# Altium schematic sheet 08_PL_ETH_1.SchDoc
size A3
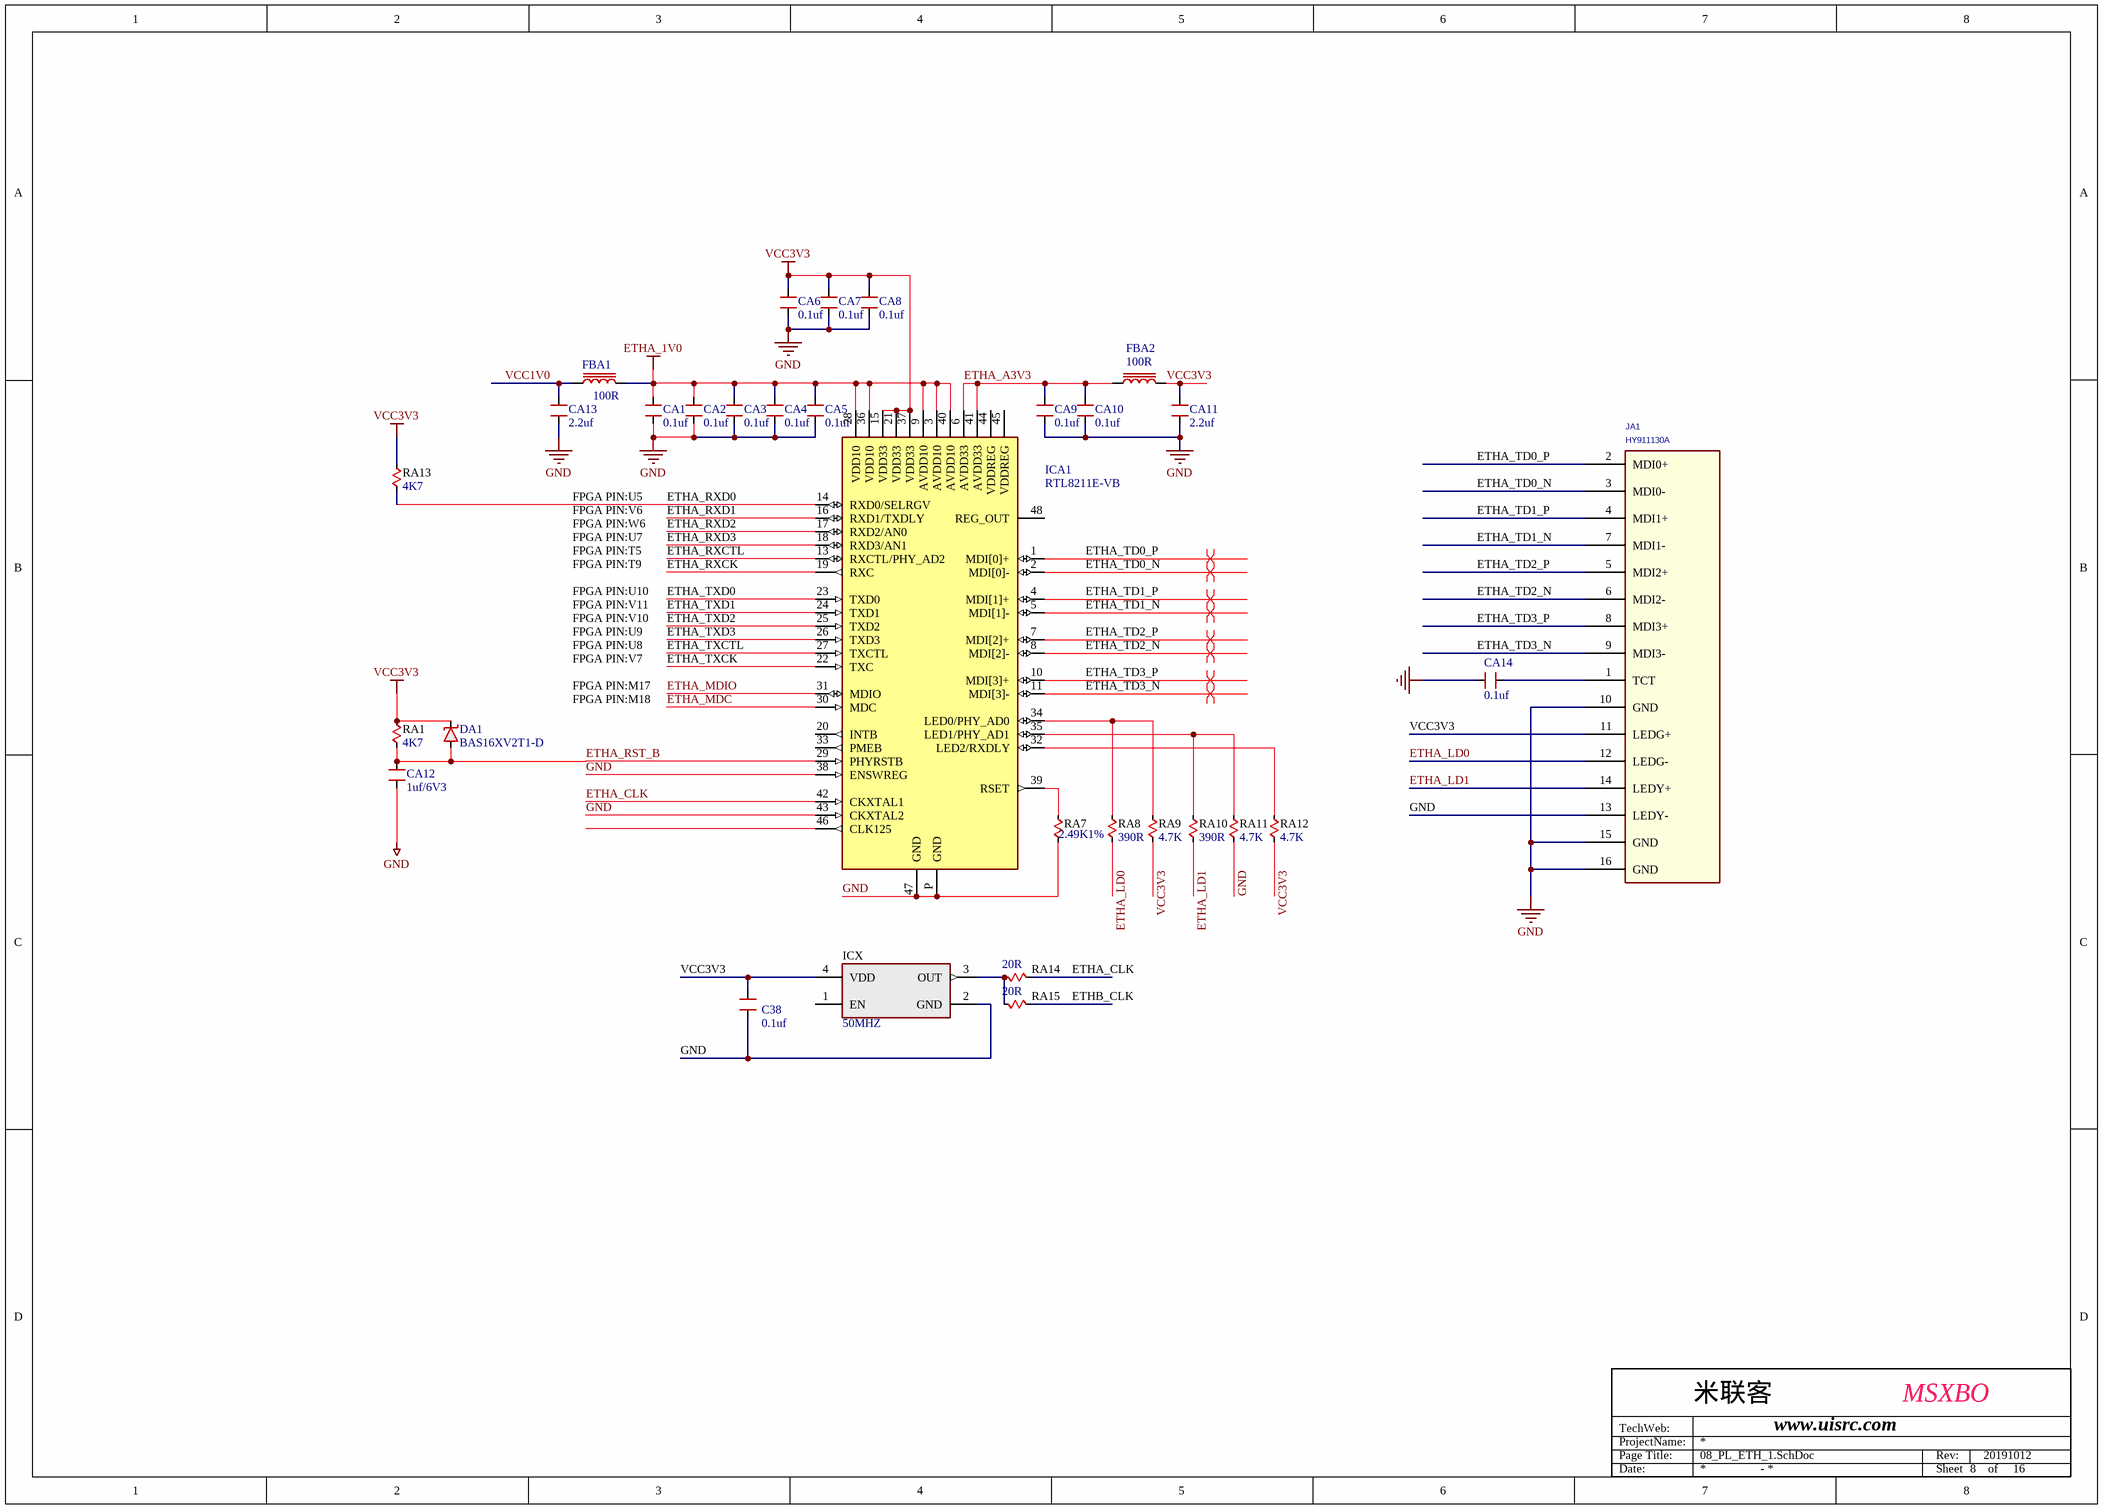
[diagram p0: 08_PL_ETH_1.SchDoc]

## Parts
C38  0.1uf  [CAP0402]
CA1  0.1uf  [CAP0402]
CA2  0.1uf  [CAP0402]
CA3  0.1uf  [CAP0402]
CA4  0.1uf  [CAP0402]
CA5  0.1uf  [CAP0402]
CA6  0.1uf  [CAP0402]
CA7  0.1uf  [CAP0402]
CA8  0.1uf  [CAP0402]
CA9  0.1uf  [CAP0402]
CA10  0.1uf  [CAP0402]
CA11  2.2uf  [CAP0402]
CA12  1uf/6V3  [CAP0402]
CA13  2.2uf  [CAP0402]
CA14  0.1uf  [CAP0402]
DA1  BAS16XV2T1-D  [SOD-523]
FBA1  100R  [CAP0603]
FBA2  100R  [CAP0603]
ICA1  RTL8211E-VB  [QFN48]
ICX  50MHZ  [3225]
JA1  HY911130A  [HY911130A]
RA1  4K7  [RES0402]
RA7  2.49K1%  [RES0402]
RA8  390R  [RES0402]
RA9  4.7K  [RES0402]
RA10  390R  [RES0402]
RA11  4.7K  [RES0402]
RA12  4.7K  [RES0402]
RA13  4K7  [RES0402]
RA14  20R  [RES0402]
RA15  20R  [RES0402]

## Nets
ETHA_1V0: CA1.1 CA2.1 CA3.1 CA4.1 CA5.1 FBA1.2 ICA1.3(AVDD10) ICA1.9(AVDD10) ICA1.28(VDD10) ICA1.36(VDD10) ICA1.40(AVDD10)
GND: C38.2 CA1.2 CA2.2 CA3.2 CA4.2 CA5.2 CA6.2 CA7.2 CA8.2 CA9.2 CA10.2 CA11.2 CA12.2 CA13.2 CA14.1 ICA1.38(ENSWREG) ICA1.43(CKXTAL2) ICA1.47(GND) ICA1.P(GND) ICX.2(GND) JA1.10(GND) JA1.13(LEDY-) JA1.15(GND) JA1.16(GND) RA7.2 RA11.2
VCC3V3: C38.1 CA6.1 CA7.1 CA8.1 CA11.1 DA1.K FBA2.2 ICA1.15(VDD33) ICA1.21(VDD33) ICA1.37(VDD33) ICX.4(VDD) JA1.11(LEDG+) RA1.1 RA9.2 RA12.2 RA13.1
ETHA_A3V3: CA9.1 CA10.1 FBA2.1 ICA1.6(AVDD33) ICA1.41(AVDD33)
ETHA_CLK: ICA1.42(CKXTAL1) RA14.2
ETHA_LD0: JA1.12(LEDG-) RA8.2
ETHA_LD1: JA1.14(LEDY+) RA10.2
ETHA_MDC: ICA1.30(MDC)
ETHA_MDIO: ICA1.31(MDIO)
ETHA_RST_B: CA12.1 DA1.A ICA1.29(PHYRSTB) RA1.2
ETHA_RXCK: ICA1.19(RXC)
ETHA_RXCTL: ICA1.13(RXCTL/PHY_AD2)
ETHA_RXD0: ICA1.14(RXD0/SELRGV) RA13.2
ETHA_RXD1: ICA1.16(RXD1/TXDLY)
ETHA_RXD2: ICA1.17(RXD2/AN0)
ETHA_RXD3: ICA1.18(RXD3/AN1)
ETHA_TD0_N: ICA1.2(MDI[0]-) JA1.3(MDI0-)
ETHA_TD0_P: ICA1.1(MDI[0]+) JA1.2(MDI0+)
ETHA_TD1_N: ICA1.5(MDI[1]-) JA1.7(MDI1-)
ETHA_TD1_P: ICA1.4(MDI[1]+) JA1.4(MDI1+)
ETHA_TD2_N: ICA1.8(MDI[2]-) JA1.6(MDI2-)
ETHA_TD2_P: ICA1.7(MDI[2]+) JA1.5(MDI2+)
ETHA_TD3_N: ICA1.11(MDI[3]-) JA1.9(MDI3-)
ETHA_TD3_P: ICA1.10(MDI[3]+) JA1.8(MDI3+)
ETHA_TXCK: ICA1.22(TXC)
ETHA_TXCTL: ICA1.27(TXCTL)
ETHA_TXD0: ICA1.23(TXD0)
ETHA_TXD1: ICA1.24(TXD1)
ETHA_TXD2: ICA1.25(TXD2)
ETHA_TXD3: ICA1.26(TXD3)
ETHB_CLK: RA15.2
VCC1V0: CA13.1 FBA1.1
NetCA14_2: CA14.2 JA1.1(TCT)
NetICA1_32: ICA1.32(LED2/RXDLY) RA12.1
NetICA1_34: ICA1.34(LED0/PHY_AD0) RA8.1 RA9.1
NetICA1_35: ICA1.35(LED1/PHY_AD1) RA10.1 RA11.1
NetICA1_39: ICA1.39(RSET) RA7.1
NetICX_3: ICX.3(OUT) RA14.1 RA15.1

Not connected (* = marked no-connect by the designer): ICA1 20(INTB) 33(PMEB) 44(VDDREG) 45(VDDREG) 46(CLK125) 48(REG_OUT); ICX 1(EN)

## Layout directives
differential pair: ETHA_TD0_N, ETHA_TD0_P, ETHA_TD1_N, ETHA_TD1_P, ETHA_TD2_N, ETHA_TD2_P, ETHA_TD3_N, ETHA_TD3_P

## Notes on the sheet
- FPGA PIN:U5
- FPGA PIN:V6
- FPGA PIN:W6
- FPGA PIN:U7
- FPGA PIN:T5
- FPGA PIN:T9
- FPGA PIN:U10
- FPGA PIN:V11
- FPGA PIN:V10
- FPGA PIN:U9
- FPGA PIN:U8
- FPGA PIN:V7
- FPGA PIN:M17
- FPGA PIN:M18
- ProjectName:
- TechWeb:
- Page Title:
- 米联客
- www.uisrc.com
- MSXBO
- Rev:
- 20191012
- Date:
- -
- Sheet
- 8    of     16

## Library data of the parts
C38 = CAPACITOR: Generic Capacitor; Value: 47nF; DPN: *; Manufacturer: *
CA1-CA11 CA13 CA14 = CAPACITOR: Generic Capacitor; DPN: *; Manufacturer: *
CA12 = CAPACITOR: Generic Capacitor; Manufacturer: Murata; Value: 47uF; DPN: *
DA1 = DIODE-SCH: Surface Mount ESD Protection Diode; Manufacturer: On Semiconductor; DPN: *
FBA1 FBA2 = Ferrite Bead: Generic Ferrite Bead; Value: 220; DPN: *; Manufacturer: *
ICA1 = RTL8211E-VL
ICX = FXO-HC5: 3.3V HCMOS Oscillator; Manufacturer: Fox Electronics; Value: 33.33MHz; DPN: *
RA1 RA7-RA13 = RESISTOR: Generic Resistor; Value: 390; Manufacturer: *; DPN: *
RA14 RA15 = RESISTOR: Generic Resistor; Value: 24; Manufacturer: *; DPN: *